# EAGLE design Modular-v1 (EAGLE 7.6.0)
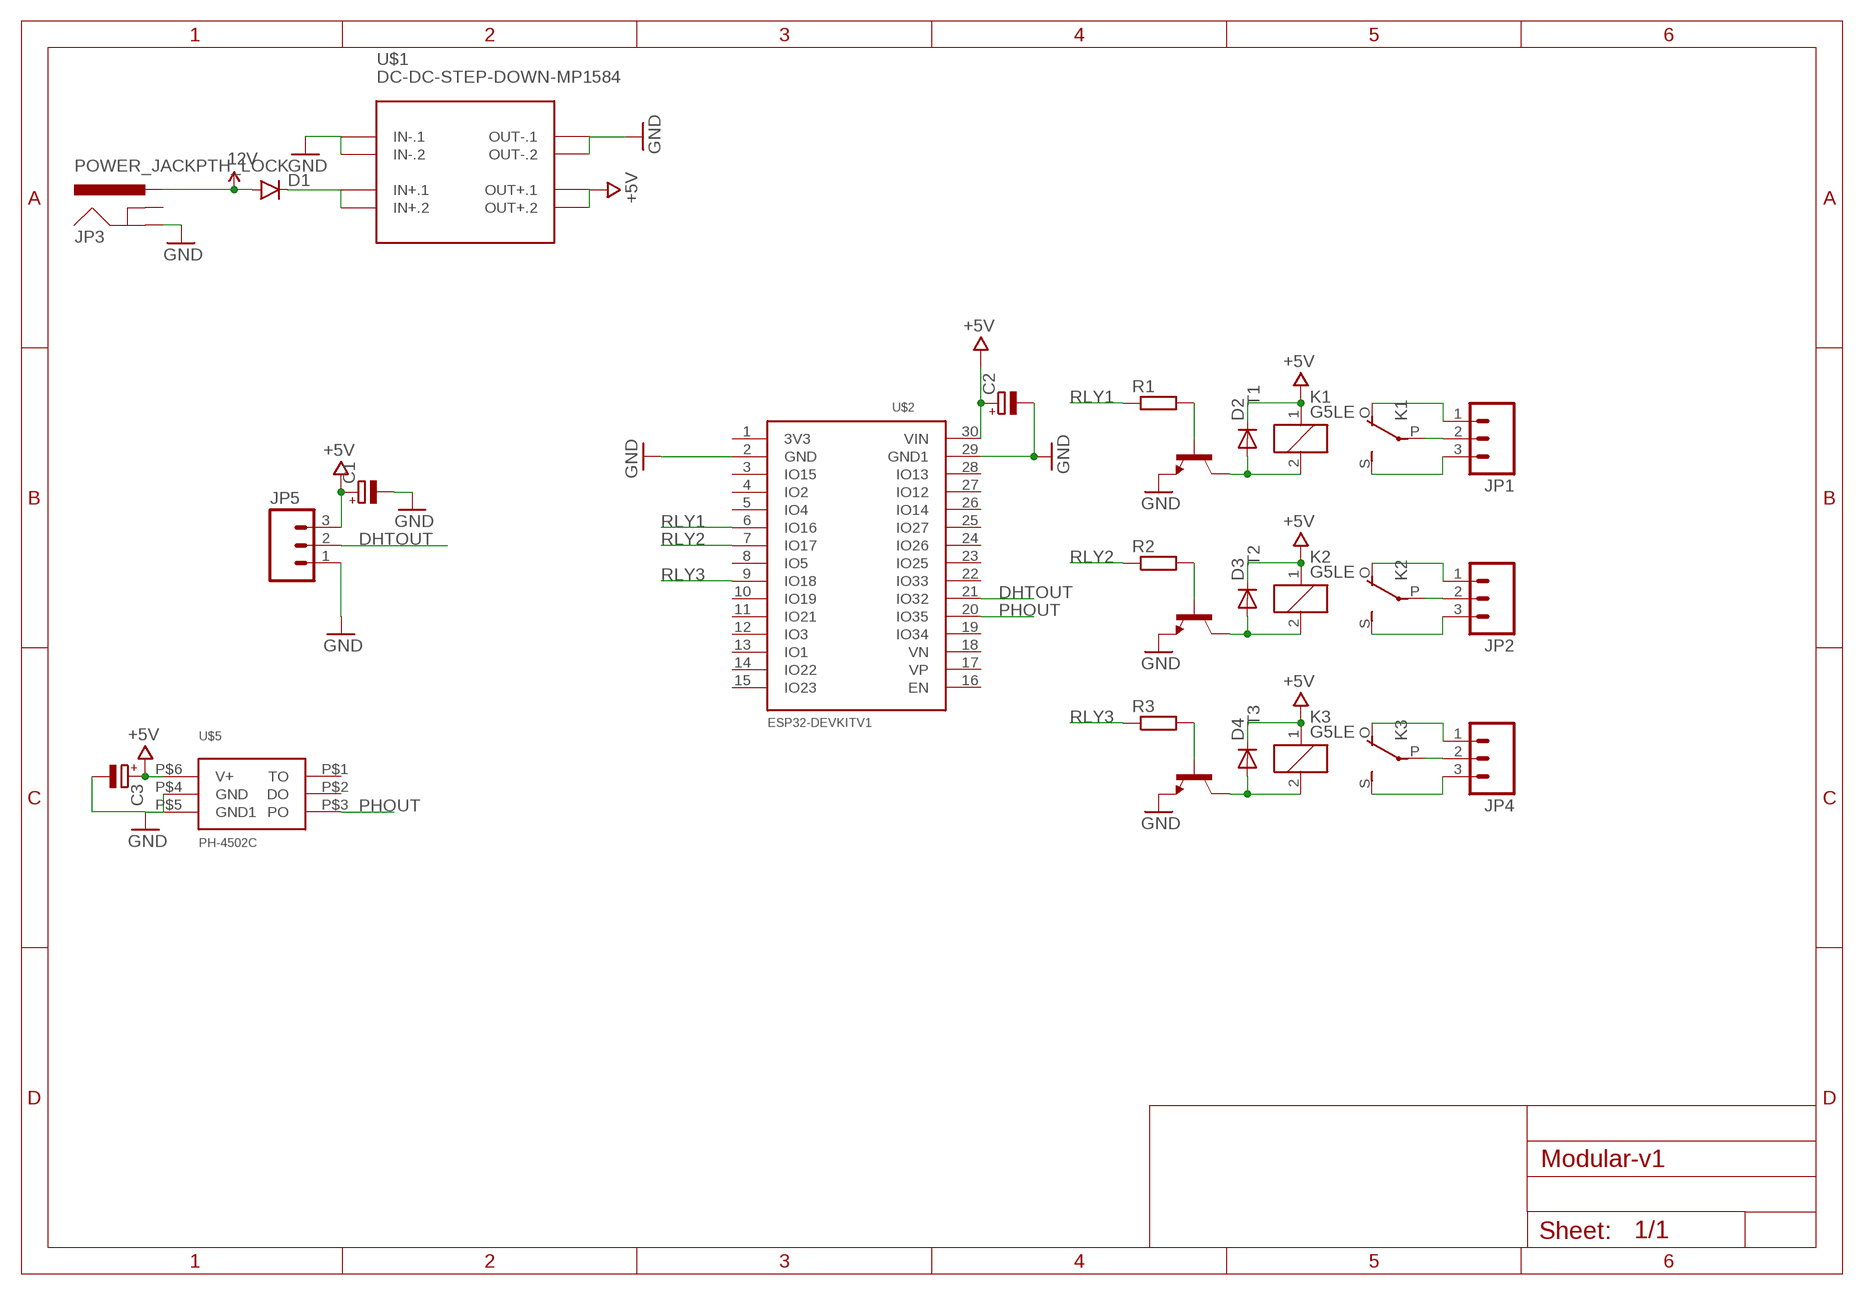
[diagram p0: schematic, sheet 1]

## Parts
C1  CPOL-EUE5-5  [E5-5]
C2  CPOL-EUE5-13  [E5-13]
C3  CPOL-EUE5-8.5  [E5-8,5]
D1  DIODEKIT  [DIODE-1N4148-KIT]
D2  DIODE-D-2.5  [D-2.5]
D3  DIODE-D-2.5  [D-2.5]
D4  DIODE-D-2.5  [D-2.5]
JP1  M03-SCREW-5MM  [SCREWTERMINAL-5MM-3]
JP2  M03-SCREW-5MM  [SCREWTERMINAL-5MM-3]
JP3  POWER_JACKPTH_LOCK  [POWER_JACK_PTH_LOCK]
JP4  M03-SCREW-5MM  [SCREWTERMINAL-5MM-3]
JP5  M03-SCREW-5MM  [SCREWTERMINAL-5MM-3]
K1  G5LE  [G5LE]
K2  G5LE  [G5LE]
K3  G5LE  [G5LE]
R1  R-EU_R0805  [R0805]
R2  R-EU_R0805  [R0805]
R3  R-EU_R0805  [R0805]
T1  -NPN-TO92-EBC  [TO92-EBC]
T2  -NPN-TO92-EBC  [TO92-EBC]
T3  -NPN-TO92-EBC  [TO92-EBC]
U$1  DC-DC-STEP-DOWN-MP1584  [DC-DC-STEP-DOWN-MP1584]
U$2  ESP32DEVKITV1  [ESP32-DEVKITV1]
U$5  PH-4502C  [PH-4502C]

## Nets
12V: D1.A JP3.PWR
+5V: C1.+ C2.+ C3.+ D2.C D3.C D4.C JP5.3 K1.1 K2.1 K3.1 U$1.OUT+.1 U$1.OUT+.2 U$2.30(VIN) U$5.P$6(V+)
DHTOUT: JP5.2 U$2.21(IO32)
GND: C1.- C2.- C3.- JP3.GND JP5.1 T1.E T2.E T3.E U$1.IN-.1 U$1.IN-.2 U$1.OUT-.1 U$1.OUT-.2 U$2.2(GND) U$2.29(GND1) U$5.P$4(GND) U$5.P$5(GND1)
N$1: D1.C U$1.IN+.1 U$1.IN+.2
N$2: JP1.2 K1.P(2:P)
N$3: JP2.2 K2.P(2:P)
N$4: JP4.2 K3.P(2:P)
N$5: D2.A K1.2 T1.C
N$6: D3.A K2.2 T2.C
N$7: D4.A K3.2 T3.C
N$8: R1.2 T1.B
N$9: R2.2 T2.B
N$10: R3.2 T3.B
N$11: JP1.1 K1.O(2:O)
N$12: JP1.3 K1.S(2:S)
N$13: JP2.1 K2.O(2:O)
N$14: JP2.3 K2.S(2:S)
N$15: JP4.1 K3.O(2:O)
N$16: JP4.3 K3.S(2:S)
PHOUT: U$2.20(IO35) U$5.P$3(PO)
RLY1: R1.1 U$2.6(IO16)
RLY2: R2.1 U$2.7(IO17)
RLY3: R3.1 U$2.9(IO18)
Unconnected: JP3.GNDBREAK U$2.1(3V3) U$2.3(IO15) U$2.4(IO2) U$2.5(IO4) U$2.8(IO5) U$2.10(IO19) U$2.11(IO21) U$2.12(IO3) U$2.13(IO1) U$2.14(IO22) U$2.15(IO23) U$2.16(EN) U$2.17(VP) U$2.18(VN) U$2.19(IO34) U$2.22(IO33) U$2.23(IO25) U$2.24(IO26) U$2.25(IO27) U$2.26(IO14) U$2.27(IO12) U$2.28(IO13) U$5.P$1(TO) U$5.P$2(DO)

## Library data of the parts
C1-C3 = rcl:CPOL-EU: POLARIZED CAPACITOR, European symbol
D1 = edes_library:DIODE: Diode These are standard reverse protection diodes and small signal diodes. SMA package can handle up to about 1A. SOD-323 can handle about 200mA. What the SOD-323 package when ordering, there are some mfgs out there that are 5-pin packages.
D2-D4 = diode:DIODE-: DIODE
JP1 JP2 JP4 JP5 = SparkFun-Connectors:M03: Header 3 Standard 3-pin 0.1" header. Use with straight break away headers (SKU : PRT-00116), right angle break away headers (PRT-00553), swiss pins (PRT-00743), machine pins (PRT-00117), and female headers (PRT-00115). Molex polarized connector foot print use with SKU : PRT-08232 with associated crimp pins and housings.; STOREFRONT_ID: PRT-08433
JP3 = SparkFun-Connectors:POWER_JACK: Power Jack This is the standard 5.5mm barrel jack for power. The PTH is the most common, proven, reliable, footprint. The Slot footprint only works if the mill layer is transmitted to the PCB fab house so be warned. Mating wall wart : TOL-00298 (and others); PROD_ID: CONN-08197; SF_ID: PRT-00119
K1-K3 = relay:G5LE: RELAY 1 x switch, 10 A/120 V AC, 8 A/30 V DC, Omron; OC_FARNELL: unknown; OC_NEWARK: unknown
R1-R3 = edes_library:R-EU_: RESISTOR, European symbol
T1-T3 = transistor:*-NPN-: NPN Transistror BF959 corrected 2008.03.06
U$1 = diy-modules-v180:DC-DC-STEP-DOWN-MP1584: DC/DC Step-Down Regulator based on MP1584 chip MP1584 datasheet available here: http://www.haoyuelectronics.com/Attachment/MP1584/MP1584.pdf Click here to find device on ebay.com <http://www.ebay.com/sch/mp1584+module>
U$2 = edes_library:ESP32DEVKITV1
U$5 = edes_library:PH-4502C

## Board
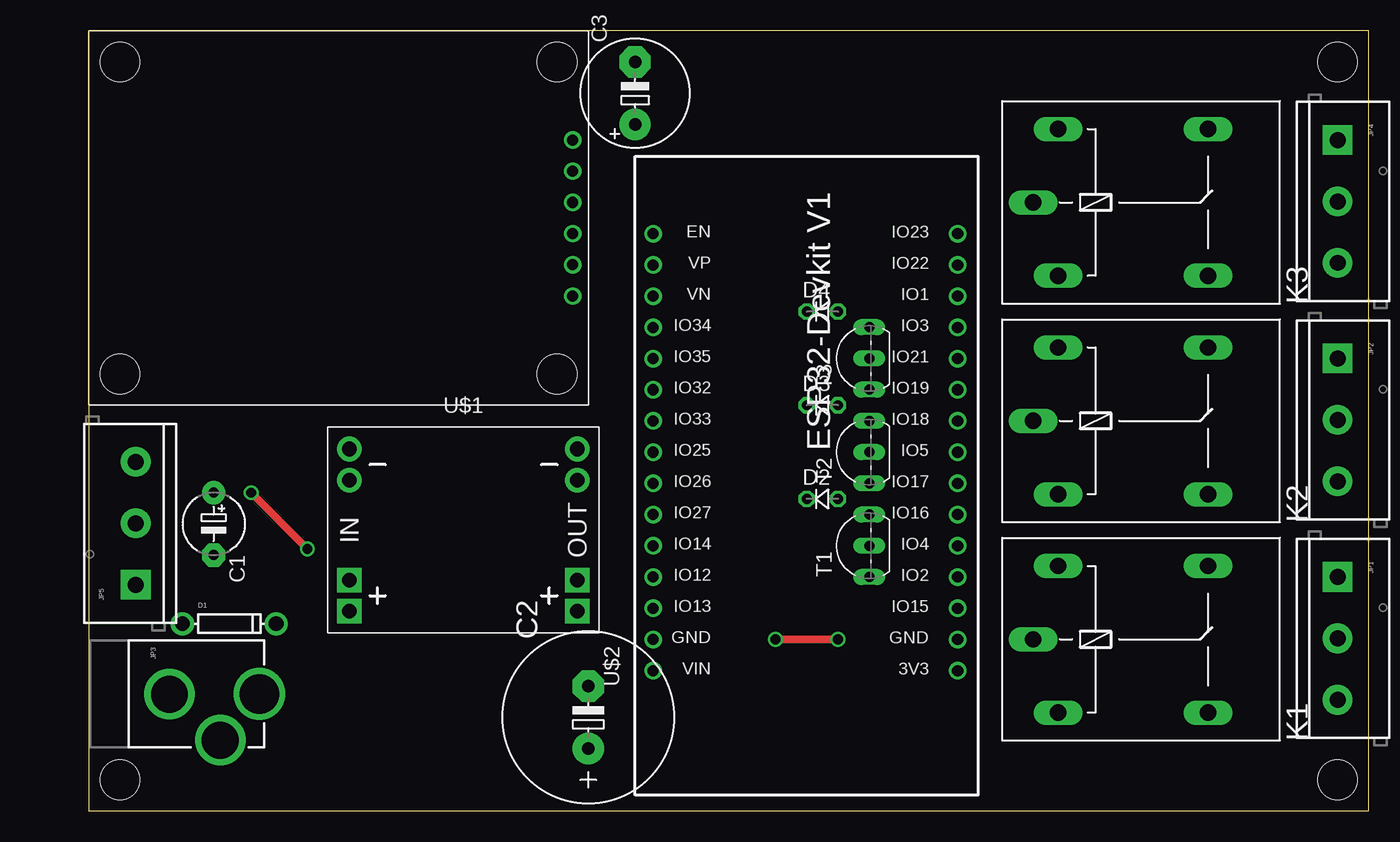
[diagram p1: board, top side]
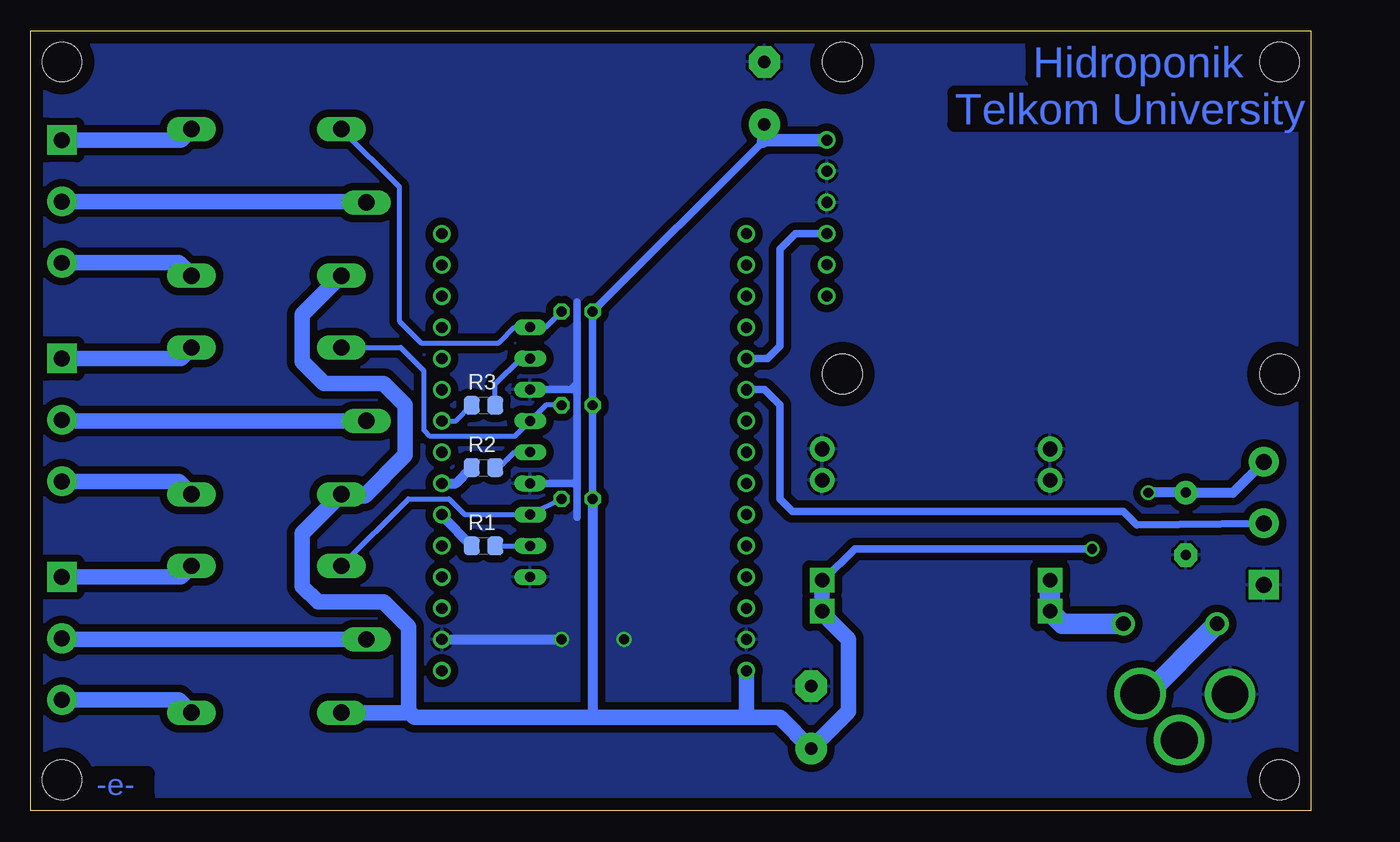
[diagram p2: board, bottom side, seen from below]

Size 104.14 x 63.5 mm. Coordinates in mm from the lower left corner, seen from the top.
Outline: 0,0 104.14,0 104.14,63.5 0,63.5 0,0
Copper layers (1*16): Top 0.035mm / dielectric 1.5mm / Bottom 0.035mm
Design rules "default": minimum track width 10mil, minimum drill 24mil, track to track 8mil, track to pad 8mil, pad to pad 8mil, via to via 8mil, smd to smd 8mil, copper to edge 40mil, drill to drill 8mil, minimum pad ring 10mil, minimum via ring 8mil, stop-mask expansion 4mil, vias tented up to drill 0mil, thermal gap 10mil
Holes 3.2 mm at 2.54,2.54 101.6,2.54 101.6,60.96

### Footprints (pad centres in the part's own frame; a part is rotated, then mirrored left to right if it is on the bottom)
E5-5 = drill 0.813 pad 1.905: + -2.54,0 | drill 0.813 pad 1.905 octagon: - 2.54,0
E5-13 = drill 1.016 pad 2.54: + -2.54,0 | drill 1.016 pad 2.54 octagon: - 2.54,0
E5-8,5 = drill 1.016 pad 2.54: + -2.54,0 | drill 1.016 pad 2.54 octagon: - 2.54,0
DIODE-1N4148-KIT = drill 1.2 pad 1.88: A -3.81,0; C 3.81,0
D-2.5 = drill 0.813 octagon: A 1.27,0; C -1.27,0
SCREWTERMINAL-5MM-3 = drill 1.3 pad 2.413 square: 1 0,0 | drill 1.3 pad 2.413: 2 5,0; 3 10,0
POWER_JACK_PTH_LOCK = drill 2.997 pad 4.115: GND 0.025,6.557; GNDBREAK 3.762,10.7 | drill 3.2 pad 4.115: PWR 0,13.878
G5LE = drill 1.321 long: 1 -7.493,-5.969; 2 -7.493,5.969; O 4.699,5.969; P -9.525,0; S 4.699,-5.969
R0805 = smd 1.3 x 1.5: 1 -0.95,0; 2 0.95,0
TO92-EBC = drill 0.813 long: B 0,-1.27; C 2.54,-1.27; E -2.54,-1.27
DC-DC-STEP-DOWN-MP1584 = drill 1.2 pad 2 square: IN+.1 -9.271,-4.064; IN+.2 -9.271,-6.604; OUT+.1 9.271,-4.064; OUT+.2 9.271,-6.604 | drill 1.2 pad 2: IN-.1 -9.271,6.604; IN-.2 -9.271,4.064; OUT-.1 9.271,6.604; OUT-.2 9.271,4.064
ESP32-DEVKITV1 = drill 0.9 pad 1.422: 1 -22.87,-13.54; 2 -20.33,-13.54; 3 -17.79,-13.54; 4 -15.25,-13.54; 5 -12.71,-13.54; 6 -10.17,-13.54; 7 -7.63,-13.54; 8 -5.09,-13.54; 9 -2.55,-13.54; 10 -0.01,-13.54; 11 2.53,-13.54; 12 5.07,-13.54; 13 7.61,-13.54; 14 10.15,-13.54; 15 12.69,-13.54; 16 12.69,11.23; 17 10.15,11.23; 18 7.61,11.23; 19 5.07,11.23; 20 2.53,11.23; 21 -0.01,11.23; 22 -2.55,11.23; 23 -5.09,11.23; 24 -7.63,11.23; 25 -10.17,11.23; 26 -12.71,11.23; 27 -15.25,11.23; 28 -17.79,11.23; 29 -20.33,11.23; 30 -22.87,11.23
PH-4502C = drill 0.9: P$1 -19.05,6.35; P$2 -19.05,3.81; P$3 -19.05,1.27; P$4 -19.05,-1.27; P$5 -19.05,-3.81; P$6 -19.05,-6.35 | hole 3.2: -17.78,12.7; -17.78,-12.7; 17.78,12.7; 17.78,-12.7

### Placement (x,y rotation side)
C1  10.16,23.37 270 top
C2  40.64,7.62 90 top
C3  44.45,58.42 90 top
D1  11.43,15.24 0 top
D2  59.69,25.4 0 top
D3  59.69,33.02 0 top
D4  59.69,40.64 0 top
JP1  101.6,19.05 270 top
JP2  101.6,36.83 270 top
JP3  0,9.53 270 top
JP4  101.6,54.61 270 top
JP5  3.81,18.41 90 top
K1  86.36,13.97 0 top
K2  86.36,31.75 0 top
K3  86.36,49.53 0 top
R1  67.31,21.59 0 bottom
R2  67.31,27.94 0 bottom
R3  67.31,33.02 0 bottom
T1  62.23,21.59 90 top
T2  62.23,29.21 90 top
T3  62.23,36.83 90 top
U$1  30.48,22.86 0 top
U$2  57.15,34.29 90 top
U$5  20.32,48.26 180 top

### Tracks (layer width: path | path; a pad name or v marks a point on that pad's centre or on a via)
12V
  Bottom 1.676: JP3.PWR 13.72,9.14 D1.A
+5V  (via drill 0.8)
  Top 0.61: v17.78,21.34 v13.21,25.91
  Bottom 0.61: D2.C D3.C D4.C 44.58,54.48 | U$1.OUT+.1 39.62,18.8 37.08,21.34 v17.78,21.34
  Bottom 0.813: D2.C 58.42,7.62 | JP5.3 6.32,25.91 C1.+ v13.21,25.91
  Bottom 1.016: U$5.P$6 44.2,54.61 | 44.2,54.61 44.45,54.61 44.58,54.48 | C3.+ 44.45,54.86 44.2,54.61
  Bottom 1.27: 73.41,8.13 73.41,14.99 75.44,17.02 80.77,17.02 82.04,18.29 82.04,22.61 K2.1 78.74,25.65 76.96,25.65 73.66,28.96 73.66,33.02 75.44,34.8 80.26,34.8 82.04,36.58 82.04,40.39 K3.1 | 73.41,8.13 72.9,7.62 58.42,7.62 45.72,7.62 | 45.72,7.62 43.18,7.62 C2.+ 37.59,8.13 37.59,13.97 39.75,16.13 U$1.OUT+.2 U$1.OUT+.1 | K1.1 73.53,8 73.41,8.13 | 45.72,7.62 45.92,7.82 U$2.30
DHTOUT
  Bottom 0.61: U$2.21 44.45,34.29 43.18,33.02 43.18,25.4 42.16,24.38 15.24,24.38 14.14,23.29 JP5.2
GND  (via drill 0.8)
  Top 0.61: v60.96,13.97 v55.88,13.97
  Bottom 0.61: 59.69,41.4 59.69,34.8 | 59.69,34.8 59.69,26.92 | 59.69,26.92 59.69,23.88 | T2.E 59.94,26.67 59.69,26.92 | T3.E 60.2,34.29 59.69,34.8
  Bottom 0.813: U$2.29 | U$2.2 v60.97,13.96 v60.96,13.97
  pour Bottom (isolate 0.61): 0,63.5 104.14,63.5 104.14,0 0,0
N$1
  Bottom 1.676: D1.C 20.19,15.24 U$1.IN+.2 U$1.IN+.1
N$2
  Bottom 1.27: K1.P 101.52,13.97 JP1.2
N$3
  Bottom 1.27: K2.P 101.52,31.75 JP2.2
N$4
  Bottom 1.27: JP4.2 76.92,49.61 K3.P
N$5
  Bottom 0.406: K1.2 73.41,25.4 70.1,25.4 68.83,24.13 T1.C D2.A
N$6
  Bottom 0.406: K2.2 74.04,37.72 72.14,35.81 72.14,30.99 71.63,30.48 64.77,30.48 T2.C 62.23,33.02 D3.A
N$7
  Bottom 0.406: K3.2 74.17,50.8 74.17,39.88 72.39,38.1 66.04,38.1 64.77,39.37 T3.C 62.23,39.37 D4.A
N$8
  Bottom 0.406: R1.2 T1.B
N$9
  Bottom 0.406: R2.2 66.04,27.94 64.77,29.21 T2.B
N$10
  Bottom 0.406: R3.2 66.36,34.73 64.26,36.83 T3.B
N$11
  Bottom 1.27: JP1.1 91.95,19.05 K1.O
N$12
  Bottom 1.27: JP1.3 92.11,9.05 K1.S
N$13
  Bottom 1.27: JP2.1 91.95,36.83 K2.O
N$14
  Bottom 1.27: JP2.3 92.11,26.83 K2.S
N$15
  Bottom 1.27: JP4.1 91.95,54.61 K3.O
N$16
  Bottom 1.27: JP4.3 92.11,44.61 K3.S
PHOUT
  Bottom 0.61: U$5.P$3 41.91,46.99 43.18,45.72 43.18,37.85 44.2,36.83 U$2.20
RLY1
  Bottom 0.406: 68.26,21.69 R1.1
  Bottom 0.813: U$2.6 70.69,24.02 R1.1
RLY2
  Bottom 0.813: U$2.7 69.54,26.66 R2.1
RLY3
  Bottom 0.406: U$2.9 69.54,31.74 R3.1

### Text on the board
Bottom: Hidroponik | Telkom University | -e-